# EAGLE design Ultrasound_PCB_Schematic (EAGLE 9.6.2)
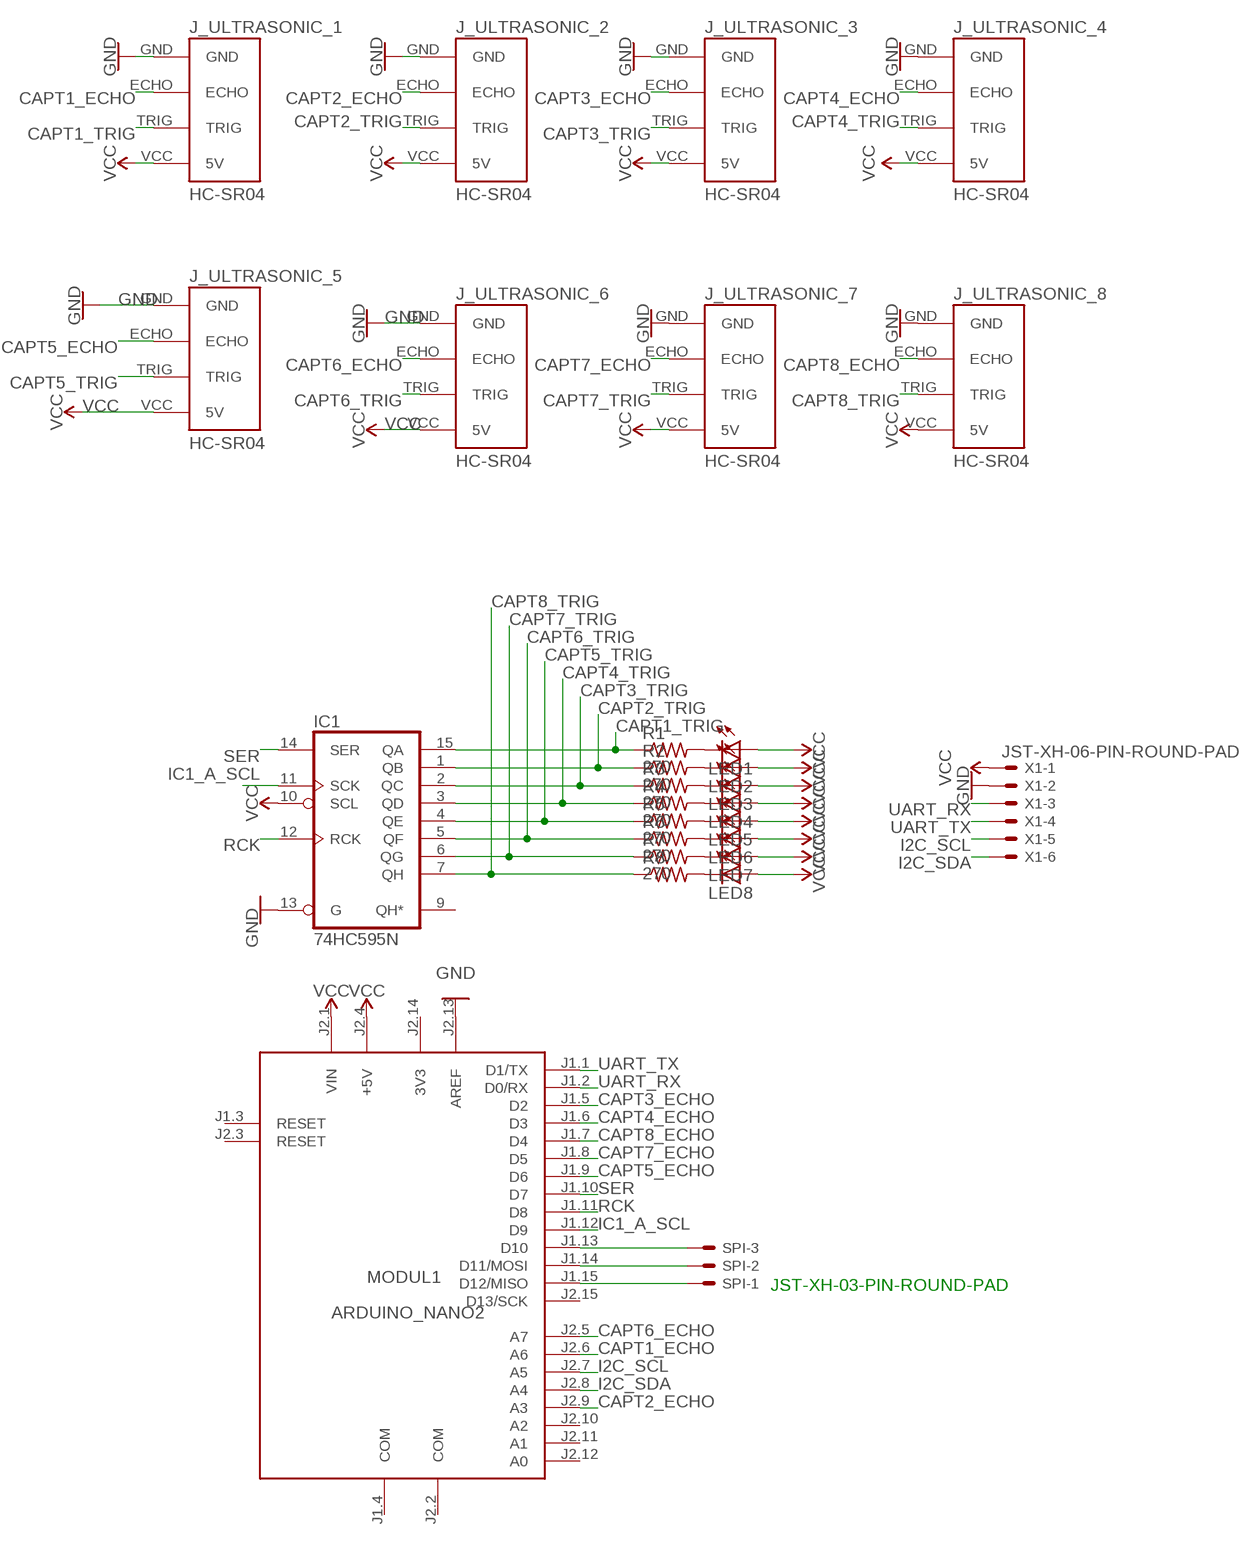
[diagram p0: schematic, sheet 1]

## Parts
IC1  74HC595N  [DIL16]
J_ULTRASONIC_1  HC-SR04  [HC-SR04_FOOTPRINT]
J_ULTRASONIC_2  HC-SR04  [HC-SR04_FOOTPRINT]
J_ULTRASONIC_3  HC-SR04  [HC-SR04_FOOTPRINT]
J_ULTRASONIC_4  HC-SR04  [HC-SR04_FOOTPRINT]
J_ULTRASONIC_5  HC-SR04  [HC-SR04_FOOTPRINT]
J_ULTRASONIC_6  HC-SR04  [HC-SR04_FOOTPRINT]
J_ULTRASONIC_7  HC-SR04  [HC-SR04_FOOTPRINT]
J_ULTRASONIC_8  HC-SR04  [HC-SR04_FOOTPRINT]
LED1  LED5MM  [LED5MM]
LED2  LED5MM  [LED5MM]
LED3  LED5MM  [LED5MM]
LED4  LED5MM  [LED5MM]
LED5  LED5MM  [LED5MM]
LED6  LED5MM  [LED5MM]
LED7  LED5MM  [LED5MM]
LED8  LED5MM  [LED5MM]
MODUL1  ARDUINO_NANO2  [ARDUINO_NANO2]
R1  270  R-US_0207/5V  [0207/5V]
R2  270  R-US_0207/5V  [0207/5V]
R3  270  R-US_0207/5V  [0207/5V]
R4  270  R-US_0207/5V  [0207/5V]
R5  270  R-US_0207/5V  [0207/5V]
R6  270  R-US_0207/5V  [0207/5V]
R7  270  R-US_0207/5V  [0207/5V]
R8  R-US_0207/5V  [0207/5V]
SPI  JST-XH-03-PIN-ROUND-PAD  [JST-XH-03-PACKAGE-ROUND-PAD]
X1  JST-XH-06-PIN-ROUND-PAD  [JST-XH-06-PACKAGE-ROUND-PAD]

## Nets
CAPT1_ECHO: J_ULTRASONIC_1.ECHO MODUL1.J2.6(A6)
CAPT1_TRIG: IC1.15(QA) J_ULTRASONIC_1.TRIG R1.1
CAPT2_ECHO: J_ULTRASONIC_2.ECHO MODUL1.J2.9(A3)
CAPT2_TRIG: IC1.1(QB) J_ULTRASONIC_2.TRIG R2.1
CAPT3_ECHO: J_ULTRASONIC_3.ECHO MODUL1.J1.5(D2)
CAPT3_TRIG: IC1.2(QC) J_ULTRASONIC_3.TRIG R3.1
CAPT4_ECHO: J_ULTRASONIC_4.ECHO MODUL1.J1.6(D3)
CAPT4_TRIG: IC1.3(QD) J_ULTRASONIC_4.TRIG R4.1
CAPT5_ECHO: J_ULTRASONIC_5.ECHO MODUL1.J1.9(D6)
CAPT5_TRIG: IC1.4(QE) J_ULTRASONIC_5.TRIG R5.1
CAPT6_ECHO: J_ULTRASONIC_6.ECHO MODUL1.J2.5(A7)
CAPT6_TRIG: IC1.5(QF) J_ULTRASONIC_6.TRIG R6.1
CAPT7_ECHO: J_ULTRASONIC_7.ECHO MODUL1.J1.8(D5)
CAPT7_TRIG: IC1.6(QG) J_ULTRASONIC_7.TRIG R7.1
CAPT8_ECHO: J_ULTRASONIC_8.ECHO MODUL1.J1.7(D4)
CAPT8_TRIG: IC1.7(QH) J_ULTRASONIC_8.TRIG R8.1
GND: IC1.13(G) J_ULTRASONIC_1.GND J_ULTRASONIC_2.GND J_ULTRASONIC_3.GND J_ULTRASONIC_4.GND J_ULTRASONIC_5.GND J_ULTRASONIC_6.GND J_ULTRASONIC_7.GND J_ULTRASONIC_8.GND MODUL1.J2.13(AREF) X1.2
I2C_SCL: MODUL1.J2.7(A5) X1.5
I2C_SDA: MODUL1.J2.8(A4) X1.6
IC1_A_SCL: IC1.11(SCK) MODUL1.J1.12(D9)
N$9: LED8.K(C) R8.2
N$19: LED7.K(C) R7.2
N$20: LED6.K(C) R6.2
N$21: LED5.K(C) R5.2
N$22: LED4.K(C) R4.2
N$27: MODUL1.J1.15(D12/MISO) SPI.1
N$28: MODUL1.J1.14(D11/MOSI) SPI.2
N$29: MODUL1.J1.13(D10) SPI.3
N$30: LED3.K(C) R3.2
N$31: LED2.K(C) R2.2
N$33: LED1.K(C) R1.2
RCK: IC1.12(RCK) MODUL1.J1.11(D8)
SER: IC1.14(SER) MODUL1.J1.10(D7)
UART_RX: MODUL1.J1.2(D0/RX) X1.3
UART_TX: MODUL1.J1.1(D1/TX) X1.4
VCC: IC1.10(SCL) J_ULTRASONIC_1.VCC(5V) J_ULTRASONIC_2.VCC(5V) J_ULTRASONIC_3.VCC(5V) J_ULTRASONIC_4.VCC(5V) J_ULTRASONIC_5.VCC(5V) J_ULTRASONIC_6.VCC(5V) J_ULTRASONIC_7.VCC(5V) J_ULTRASONIC_8.VCC(5V) LED1.A LED2.A LED3.A LED4.A LED5.A LED6.A LED7.A LED8.A MODUL1.J2.1(VIN) MODUL1.J2.4(+5V) X1.1
Unconnected: IC1.9(QH*) MODUL1.J1.3(RESET) MODUL1.J2.3(RESET) MODUL1.J2.10(A2) MODUL1.J2.11(A1) MODUL1.J2.12(A0) MODUL1.J2.15(D13/SCK)

## Power pins joined to a net without a drawn wire
3V3: MODUL1.J2.14(3V3)
COM: MODUL1.J1.4(COM) MODUL1.J2.2(COM)
GND: IC1.8(GND)
VCC: IC1.16(VCC)

## Library data of the parts
IC1 = 74xx-eu:74*595: 8-bit SHIFT REGISTER, output latch
J_ULTRASONIC_1-J_ULTRASONIC_8 = Ultrasonic Sensor HC RS04:HC-SR04: Ultrasonic Sensor HC-SR04
LED1-LED8 = adafruit:LED: LED OSRAM: - CHIPLED LG R971, LG N971, LY N971, LG Q971, LY Q971, LO R971, LY R971 LH N974, LH R974 LS Q976, LO Q976, LY Q976 LO Q996 - Hyper CHIPLED LW Q18S LB Q993, LB Q99A, LB R99A - SideLED LS A670, LO A670, LY A670, LG A670, LP A670 LB A673, LV A673, LT A673, LW A673 LH A674 LY A675 LS A676, LA A676, LO A676, LY A676, LW A676 LS A679, LY A679, LG A679 - Hyper Micro SIDELED® LS Y876, LA Y876, LO Y876, LY Y876 LT Y87S - SmartLED LW L88C, LW L88S LB L89C, LB L89S, LG L890 LS L89K, LO L89K, LY L89K LS L896, LA L896, LO L896, LY L896 - TOPLED LS T670, LO T670, LY T670, LG T670, LP T670 LSG T670, LSP T670, LSY T670, LOP T670, LYG T670 LG T671, LOG T671, LSG T671 LB T673, LV T673, LT T673, LW T673 LH T674 LS T676, LA T676, LO T676, LY T676, LB T676, LH T676, LSB T676, LW T676 LB T67C, LV T67C, LT T67C, LS T67K, LO T67K, LY T67K, LW E67C LS E67B, LA E67B, LO E67B, LY E67B, LB E67C, LV E67C, LT E67C LW T67C LS T679, LY T679, LG T679 LS T770, LO T770, LY T770, LG T770, LP T770 LB T773, LV T773, LT T773, LW T773 LH T774 LS E675, LA E675, LY E675, LS T675 LS T776, LA T776, LO T776, LY T776, LB T776 LHGB T686 LT T68C, LB T68C - Hyper Mini TOPLED® LB M676 - Mini TOPLED Santana® LG M470 LS M47K, LO M47K, LY M47K Source: http://www.osram.convergy.de/
MODUL1 = arduino:ARDUINO_NANO2: Arduino Nano2 Auto generated by modulcreator.ulp \;; ANZAHL: 2; MODUL: TRUE; STECKX0: -76200; STECKX1: 76200; STECKY0: 177800; STECKY1: 177800
R1-R8 = adafruit:R-US_: RESISTOR, American symbol
SPI = Rembrandt Electronics - JST XH Connectors v1-0:JST-XH-03-PIN: JST XH Connector 2 Pin Wire to board connector. Pitch: 2,54 mm, (0.100") Number of pins: 3 Created by Rembrandt Electronics www.rembrandtelectronics.com; SPICEPREFIX: X
X1 = Rembrandt Electronics - JST XH Connectors v1-0:JST-XH-06-PIN: JST XH Connector 2 Pin Wire to board connector. Pitch: 2,54 mm, (0.100") Number of pins: 6 Created by Rembrandt Electronics www.rembrandtelectronics.com

## Net classes
0 default: width 1 mm, drill 1 mm

## Board
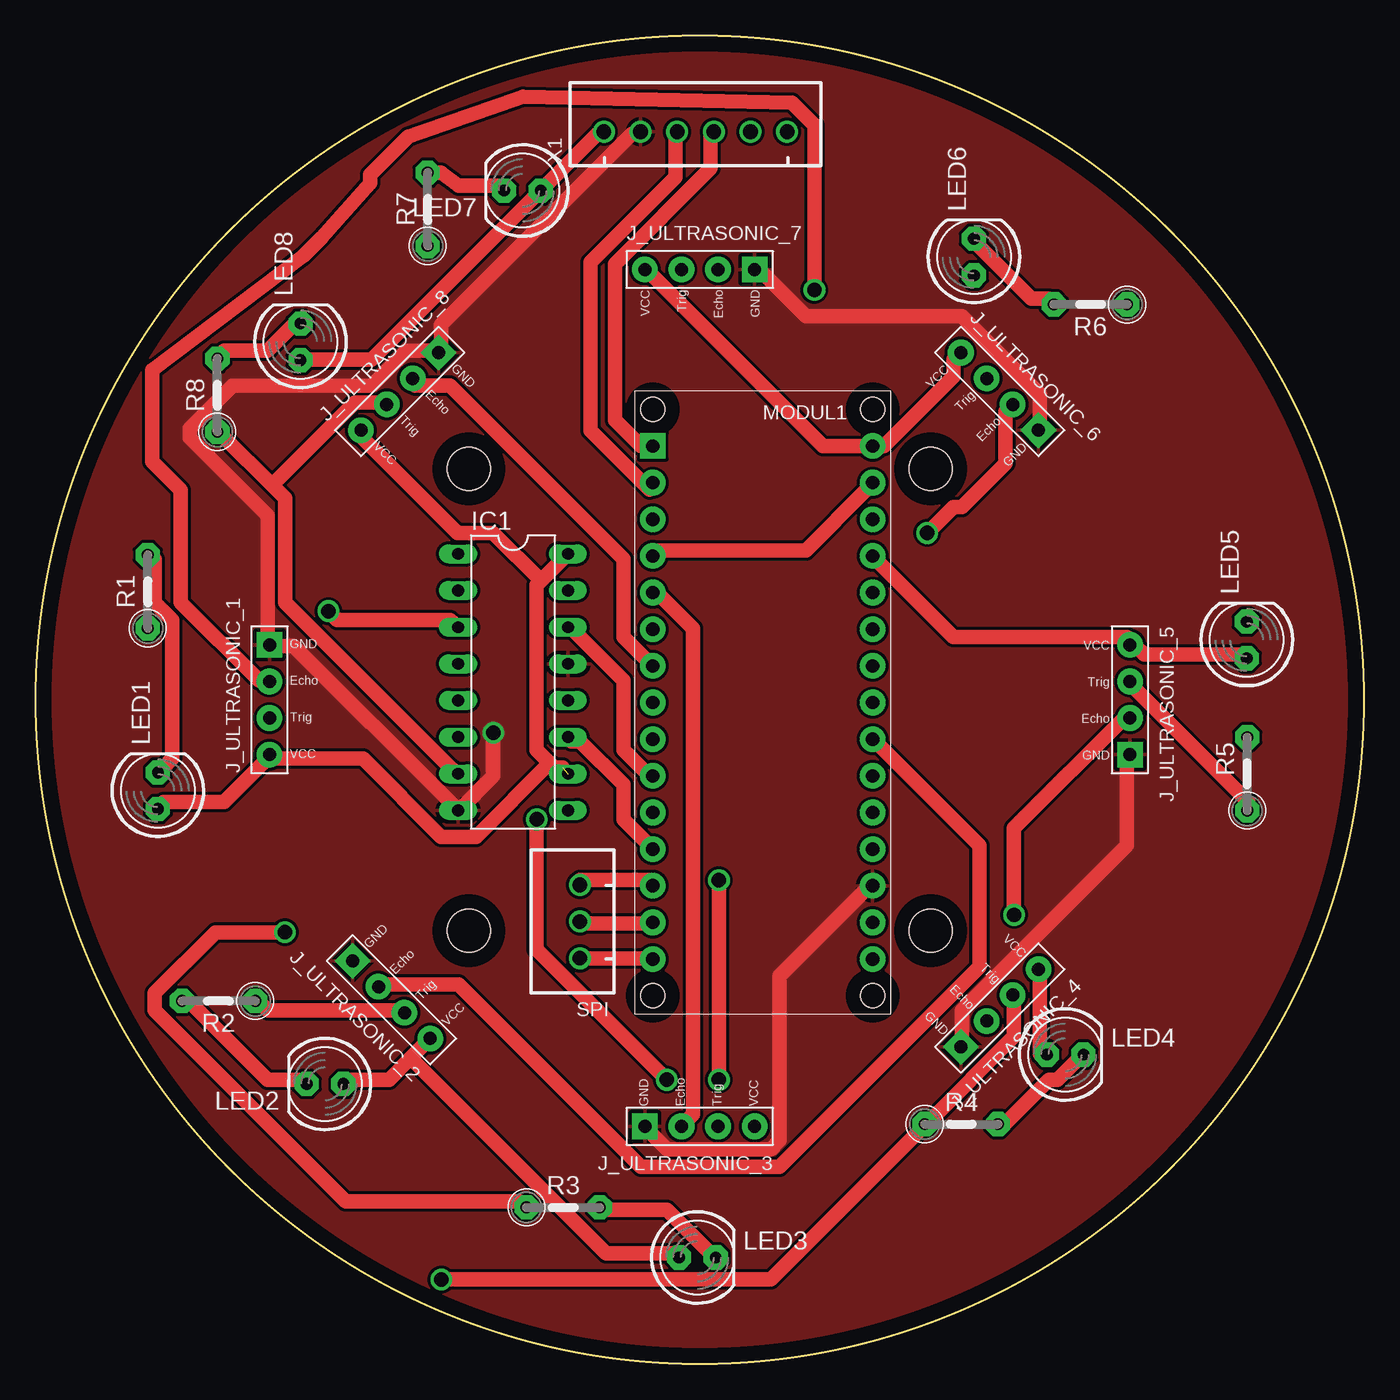
[diagram p1: board, top side]
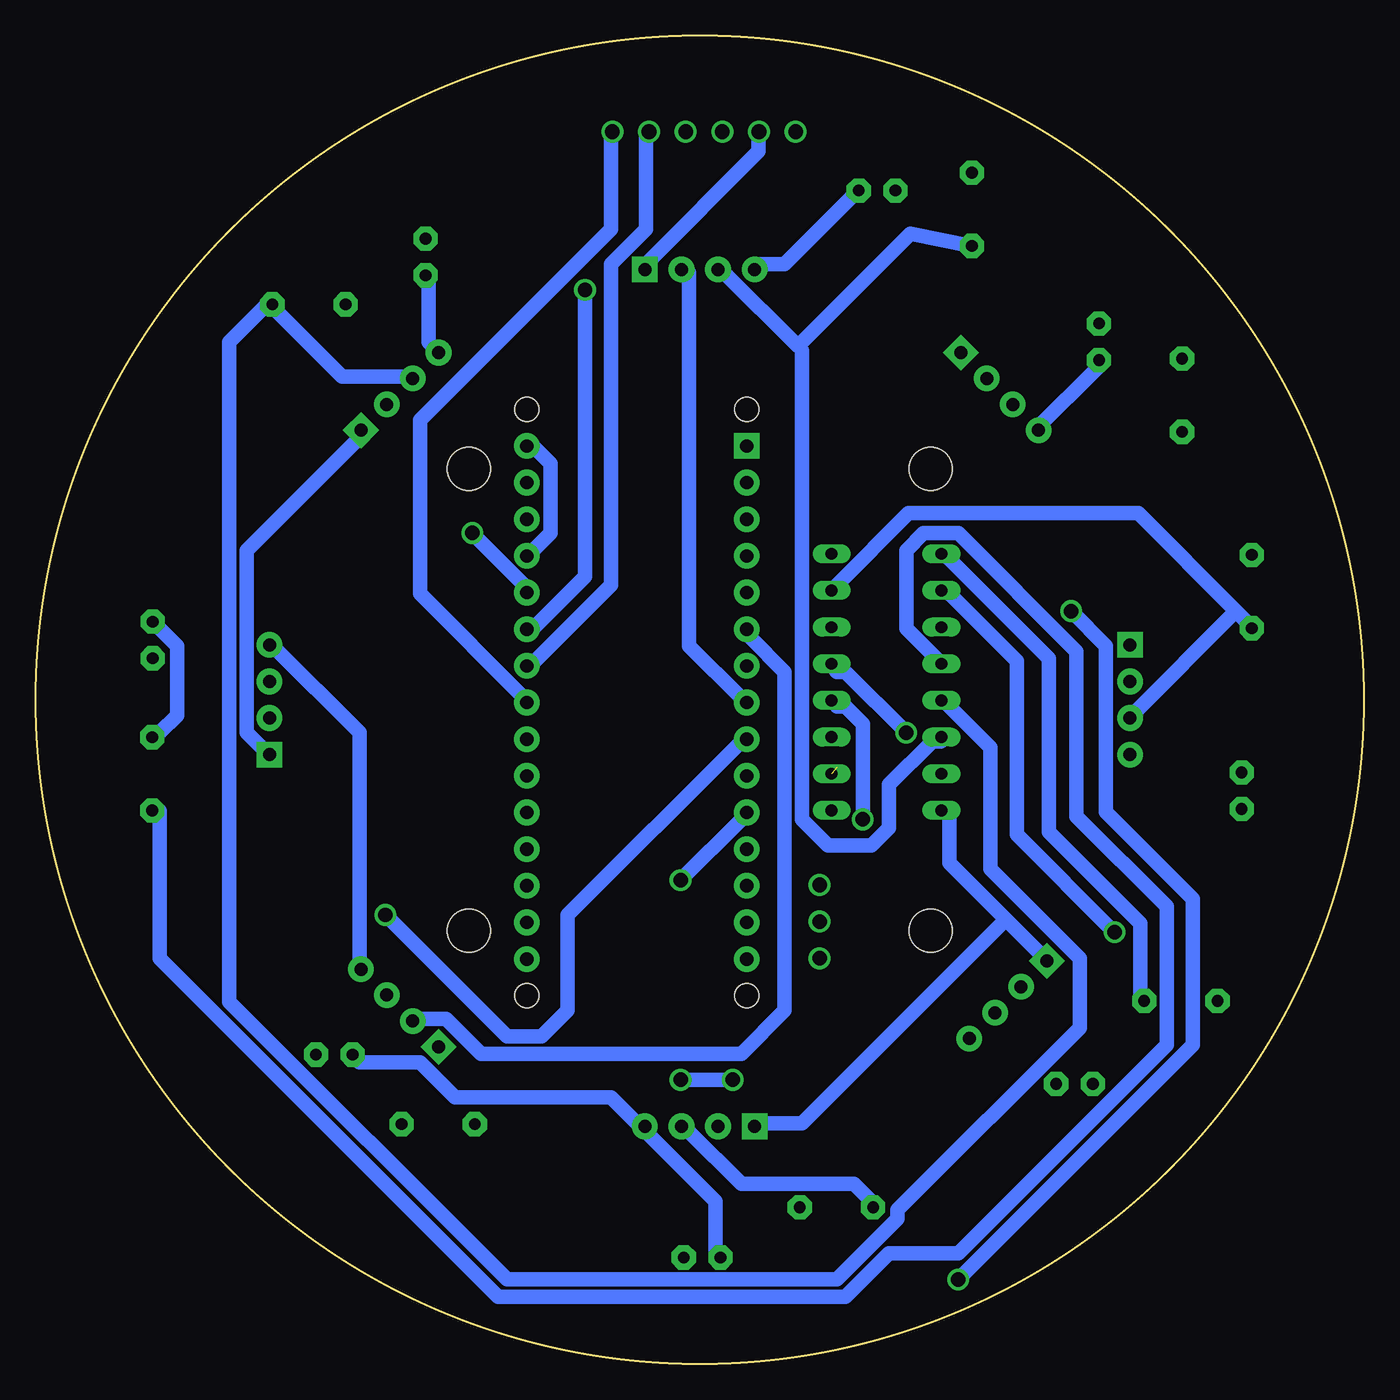
[diagram p2: board, bottom side, seen from below]

Size 92 x 92 mm. Coordinates in mm from the lower left corner, seen from the top.
Outline: circle at 46,46 radius 46
Copper layers (1*16): Top 0.035mm / dielectric 1.5mm / Bottom 0.035mm
Design rules "default *": minimum track width 6mil, minimum drill 0.35mm, track to track 8mil, track to pad 6mil, pad to pad 6mil, via to via 6mil, smd to smd 6mil, copper to edge 40mil, drill to drill 6mil, minimum pad ring 10mil, minimum via ring 8mil, stop-mask expansion 4mil, vias tented up to drill 0mil, thermal gap 10mil
Holes 3 mm at 30,30 62,62 30,62 62,30

### Footprints (pad centres in the part's own frame; a part is rotated, then mirrored left to right if it is on the bottom)
DIL16 = drill 0.813 long: 1 -8.89,-3.81; 2 -6.35,-3.81; 3 -3.81,-3.81; 4 -1.27,-3.81; 5 1.27,-3.81; 6 3.81,-3.81; 7 6.35,-3.81; 8 8.89,-3.81; 9 8.89,3.81; 10 6.35,3.81; 11 3.81,3.81; 12 1.27,3.81; 13 -1.27,3.81; 14 -3.81,3.81; 15 -6.35,3.81; 16 -8.89,3.81
HC-SR04_FOOTPRINT = drill 0.9 pad 1.778: ECHO 0,1.27; TRIG 0,-1.27; VCC 0,-3.81 | drill 0.9 pad 1.778 square: GND 0,3.81
LED5MM = drill 0.813 pad 1.676 octagon: A -1.27,0; K 1.27,0
ARDUINO_NANO2 = drill 0.914 pad 1.778 square: J1.1 -7.62,17.78 | drill 0.914 pad 1.778: J1.2 -7.62,15.24; J1.3 -7.62,12.7; J1.4 -7.62,10.16; J1.5 -7.62,7.62; J1.6 -7.62,5.08; J1.7 -7.62,2.54; J1.8 -7.62,0; J1.9 -7.62,-2.54; J1.10 -7.62,-5.08; J1.11 -7.62,-7.62; J1.12 -7.62,-10.16; J1.13 -7.62,-12.7; J1.14 -7.62,-15.24; J1.15 -7.62,-17.78; J2.1 7.62,17.78; J2.2 7.62,15.24; J2.3 7.62,12.7; J2.4 7.62,10.16; J2.5 7.62,7.62; J2.6 7.62,5.08; J2.7 7.62,2.54; J2.8 7.62,0; J2.9 7.62,-2.54; J2.10 7.62,-5.08; J2.11 7.62,-7.62; J2.12 7.62,-10.16; J2.13 7.62,-12.7; J2.14 7.62,-15.24; J2.15 7.62,-17.78 | hole 1.651: -7.62,-20.32; 7.62,-20.32; 7.62,20.32; -7.62,20.32
0207/5V = drill 0.813 pad 1.676 octagon: 1 -2.54,0; 2 2.54,0
JST-XH-03-PACKAGE-ROUND-PAD = drill 1.016: 1 -2.54,0; 2 0,0; 3 2.54,0
JST-XH-06-PACKAGE-ROUND-PAD = drill 1.016: 1 -6.35,0; 2 -3.81,0; 3 -1.27,0; 4 1.27,0; 5 3.81,0; 6 6.35,0

### Placement (x,y rotation side)
IC1  33.06,47.22 270 top
J_ULTRASONIC_1  16.18,46 0 top
J_ULTRASONIC_2  24.63,25.21 45 top
J_ULTRASONIC_3  46,16.43 90 top
J_ULTRASONIC_4  66.79,24.63 135 top
J_ULTRASONIC_5  75.82,46 180 top
J_ULTRASONIC_6  66.79,67.37 225 top
J_ULTRASONIC_7  46,75.82 270 top
J_ULTRASONIC_8  25.21,67.37 315 top
LED1  8.44,39.69 90 top
LED2  20.03,19.37 180 top
LED3  45.84,7.34 0 top
LED4  71.33,21.41 0 top
LED5  83.91,50.14 90 top
LED6  65.01,76.69 90 top
LED7  33.71,81.29 180 top
LED8  18.33,70.81 90 top
MODUL1  50.36,45.81 0 top
R1  7.74,53.5 90 top
R2  12.65,25.12 180 top
R3  36.53,10.82 0 top
R4  64.13,16.59 0 top
R5  83.95,40.86 90 top
R6  73.08,73.4 180 top
R7  27.14,79.99 90 top
R8  12.56,67.1 90 top
SPI  37.69,30.62 90 top
X1  45.7,85.37 0 top

### Tracks (layer width: path | path; a pad name or v marks a point on that pad's centre or on a via)
CAPT1_ECHO  (via drill 1)
  Top 1: v53.95,74.4 53.95,85.83 52.39,87.39 33.76,87.8 25.79,85.02 23.16,82.39 23.16,81.81 19.78,78.03 18.53,76.79 8.06,68.84 8.06,62.52 10.03,60.54 10.03,52.75 15.45,47.33 16.05,47.33 J_ULTRASONIC_1.ECHO
  Bottom 1: v53.95,74.4 53.95,54.55 57.56,50.94 MODUL1.J2.6
CAPT1_TRIG
  Bottom 1: 8.83,52.14 8.23,51.54 R1.1 | 8.83,52.14 15.61,58.93 31.52,58.93 36.5,53.95 IC1.15 | 8.83,52.14 16.05,44.92 J_ULTRASONIC_1.TRIG
CAPT2_ECHO
  Top 1: MODUL1.J2.9 58.16,43.12 65.38,35.9 65.38,27.48 51.54,13.64 41.92,13.64 29.28,26.27 23.87,26.27 J_ULTRASONIC_2.ECHO
CAPT2_TRIG
  Top 1: R2.1 15.45,25.07 16.05,24.47 25.07,24.47 J_ULTRASONIC_2.TRIG
  Bottom 1: IC1.1 28.68,55.75 21.79,48.86 21.79,36.83 15.45,30.49 15.45,25.67 R2.1
CAPT3_ECHO
  Top 1: MODUL1.J1.5 43.12,53.35 45.53,50.94 45.53,17.25 44.92,16.65 J_ULTRASONIC_3.ECHO
CAPT3_TRIG  (via drill 1)
  Top 1: v17.25,29.89 12.44,29.89 8.23,25.67 8.23,24.47 21.46,11.23 33.49,11.23 R3.1
  Bottom 1: v17.25,29.89 24.02,36.65 24.02,48.68 28.68,53.35 IC1.2 | R3.1 34.1,11.23 35.3,12.44 43.12,12.44 46.73,16.05 J_ULTRASONIC_3.TRIG
CAPT4_ECHO
  Bottom 1: MODUL1.J1.6 42.52,50.34 40.11,47.93 40.11,24.47 43.12,21.46 61.17,21.46 63.57,23.87 65.38,23.87 J_ULTRASONIC_4.ECHO
CAPT4_TRIG  (via drill 1)
  Top 1: v20.26,52.14 20.86,51.54 28.68,51.54 IC1.3 | v28.08,5.82 50.94,5.82 61.17,16.05 R4.1 61.77,16.65 67.79,22.67 67.79,25.07 J_ULTRASONIC_4.TRIG
  Bottom 1: v20.26,52.14 17.85,49.74 17.85,38.23 11.81,32.19 11.81,22.09 v28.08,5.82
CAPT5_ECHO  (via drill 1)
  Top 1: v67.79,31.09 67.79,37.1 75.61,44.92 J_ULTRASONIC_5.ECHO
  Bottom 1: v67.79,31.09 59.36,22.67 56.96,22.67 55.15,24.47 55.15,31.09 43.12,43.12 MODUL1.J1.9
CAPT5_TRIG
  Top 1: R5.1 84.03,38.91 76.21,46.73 J_ULTRASONIC_5.TRIG
  Bottom 1: IC1.4 29.28,48.53 31.69,50.94 31.69,56.35 30.49,57.56 28.08,57.56 19.88,49.36 19.88,37.9 13.64,31.66 13.64,22.06 28.08,7.63 32.89,7.63 35.9,4.62 59.97,4.62 83.43,28.08 83.43,38.31 R5.1
CAPT6_ECHO  (via drill 1)
  Top 1: MODUL1.J2.5 57.98,53.42 57.62,53.42 | v61.77,57.56 63.57,59.36 64.18,59.36 67.18,62.37 67.18,65.98 J_ULTRASONIC_6.ECHO
  Bottom 1: v61.77,57.56 58.16,53.95 MODUL1.J2.5
CAPT6_TRIG
  Bottom 1: IC1.5 28.68,45.53 25.85,42.69 25.85,34.27 19.66,28.08 19.66,23.27 32.29,10.63 32.29,10.03 36.5,5.82 59.36,5.82 78.61,25.07 78.61,70.79 76.21,73.2 R6.1 75.61,73.2 70.79,68.39 65.98,68.39 J_ULTRASONIC_6.TRIG
CAPT7_ECHO
  Bottom 1: MODUL1.J1.8 43.12,46.13 46.73,49.74 46.73,75.61 J_ULTRASONIC_7.ECHO
CAPT7_TRIG
  Bottom 1: 39.21,70.49 44.32,75.61 J_ULTRASONIC_7.TRIG | 39.21,70.49 38.91,70.19 38.91,37.71 37.1,35.9 34.1,35.9 32.89,37.1 32.89,40.11 29.89,43.12 29.28,43.12 IC1.6 | 39.21,70.49 31.41,78.29 R7.1
CAPT8_ECHO
  Top 1: MODUL1.J1.7 42.52,48.53 40.71,50.34 40.71,55.75 28.68,67.79 26.27,67.79 J_ULTRASONIC_8.ECHO
CAPT8_TRIG
  Top 1: 16.35,60.87 13.04,64.18 R8.1 | 16.35,60.87 17.25,59.97 17.25,52.75 28.68,41.31 IC1.7 | 16.35,60.87 22.06,66.58 23.87,66.58 J_ULTRASONIC_8.TRIG
COM
  Top 1: MODUL1.J1.4 43.12,56.35 53.35,56.35 57.56,60.57 MODUL1.J2.2
GND  (via drill 1)
  Top 1: v31.69,43.72 31.69,40.71 29.28,38.31 IC1.8 28.68,38.91 17.85,49.74 16.65,49.74 J_ULTRASONIC_1.GND 16.05,50.34 16.05,58.76 10.63,64.18 10.63,64.78 13.64,67.79 23.27,67.79 25.67,70.19 27.48,70.19 J_ULTRASONIC_8.GND 28.08,70.19 28.08,72 41.31,85.23 X1.2 | MODUL1.J2.13 57.56,32.89 51.54,26.88 51.54,15.45 50.94,14.84 43.72,14.84 42.52,16.05 J_ULTRASONIC_3.GND | J_ULTRASONIC_4.GND 64.18,22.06 64.18,24.47 75.61,35.9 75.61,41.92 J_ULTRASONIC_5.GND | J_ULTRASONIC_6.GND 69.59,64.78 69.59,67.18 64.18,72.6 53.35,72.6 50.34,75.61 J_ULTRASONIC_7.GND
  Bottom 1: 24.77,30.79 22.06,28.08 J_ULTRASONIC_2.GND | 24.77,30.79 28.68,34.7 28.68,38.31 IC1.8 | v31.69,43.72 35.9,47.93 36.5,47.93 IC1.13 | 24.77,30.79 38.91,16.65 41.92,16.65 J_ULTRASONIC_3.GND | X1.2 41.92,85.23 41.92,84.03 49.74,76.21 J_ULTRASONIC_7.GND | J_ULTRASONIC_5.GND 76.21,42.52 77.41,43.72 77.41,56.35 69.59,64.18 J_ULTRASONIC_6.GND
  pour Top: 71.05,93.63 94.8,69.88 94.8,16.27 77.72,-0.82 19.62,-0.82 -0.82,19.63 -0.82,60.75 9.95,89.89 13.7,93.63
I2C_SCL
  Bottom 1: X1.5 49.74,85.23 49.74,78.61 52.14,76.21 52.14,53.95 57.56,48.53 MODUL1.J2.7
I2C_SDA
  Bottom 1: X1.6 52.14,85.23 52.14,78.61 65.38,65.38 65.38,53.35 58.16,46.13 MODUL1.J2.8
IC1_A_SCL
  Top 1: IC1.11 37.1,43.12 37.71,43.12 40.71,40.11 40.71,37.71 42.52,35.9 MODUL1.J1.12
N$9
  Top 1: R8.2 13.04,70.19 16.05,70.19 17.85,72 LED8.K
N$19
  Top 1: LED7.K 32.29,81.62 29.28,81.62 28.09,82.53 R7.2
N$20
  Top 1: R6.2 70.19,73.8 68.99,73.8 65.38,77.41 LED6.K
N$21
  Bottom 1: LED5.K 83.43,50.94 82.22,49.74 82.22,44.92 83.43,43.72 R5.2
N$22
  Top 1: R4.2 67.18,16.65 70.19,19.66 70.79,19.66 72,20.86 LED4.K
N$27
  Top 1: SPI.1 37.71,28.08 42.52,28.08 MODUL1.J1.15
N$28
  Top 1: SPI.2 37.71,30.49 42.52,30.49 MODUL1.J1.14
N$29
  Top 1: SPI.3 37.71,33.49 42.52,33.49 MODUL1.J1.13
N$30
  Top 1: LED3.K 46.73,7.63 43.72,10.63 39.51,10.63 R3.2
N$31
  Top 1: LED2.K 18.45,19.66 16.05,19.66 10.63,25.07 R2.2
N$33
  Top 1: R1.2 8.23,55.75 8.23,52.75 9.43,51.54 9.43,41.92 8.83,41.31 LED1.K
RCK  (via drill 1)
  Top 1: v34.7,37.71 34.7,28.68 v43.72,19.66 | v47.33,33.49 v47.33,19.66
  Bottom 1: v34.7,37.71 34.7,44.32 35.9,45.53 36.5,45.53 IC1.12 | v47.33,19.66 v43.72,19.66 | v47.33,33.49 43.12,37.71 MODUL1.J1.11
SER
  Top 1: MODUL1.J1.10 42.52,40.71 40.71,42.52 40.71,47.33 37.1,50.94 IC1.14
UART_RX
  Top 1: MODUL1.J1.2 42.52,60.57 38.42,64.67 38.42,76.32 44.32,82.22 44.32,85.23 X1.3
UART_TX
  Top 1: MODUL1.J1.1 42.52,63.57 41.92,63.57 40.11,65.38 40.11,76.21 46.73,82.83 46.73,85.23 X1.4
VCC  (1 unrouted)
  Top 1: 25.97,21.16 26.88,22.06 J_ULTRASONIC_2.VCC | 25.97,21.16 24.47,19.66 21.46,19.66 LED2.A | LED4.A 69.59,21.46 69.59,26.88 J_ULTRASONIC_4.VCC | 25.97,21.16 39.51,7.63 44.32,7.63 LED3.A | LED1.A 8.83,38.91 13.04,38.91 16.05,41.92 J_ULTRASONIC_1.VCC 16.65,41.92 22.67,41.92 28.08,36.5 30.49,36.5 35.6,41.62 | 36.5,41.31 35.9,41.31 35.6,41.62 | 35.6,41.62 34.7,42.52 34.7,53.95 35,54.25 | 35,54.25 36.5,55.75 IC1.16 | 35,54.25 31.69,57.56 29.2,57.56 22.7,64.06 J_ULTRASONIC_8.VCC | X1.1 38.91,85.23 35.3,81.62 LED7.A 34.7,81.02 23.27,69.59 18.45,69.59 LED8.A | LED5.A 83.43,49.14 76.81,49.14 76.21,49.74 J_ULTRASONIC_5.VCC 75.61,50.34 63.57,50.34 58.16,55.75 MODUL1.J2.4 | J_ULTRASONIC_6.VCC 63.57,69.59 63.57,68.39 58.76,63.57 58.16,63.57 MODUL1.J2.1 57.56,63.57 54.55,63.57 42.52,75.61 J_ULTRASONIC_7.VCC
  Bottom 1: LED3.A 44.92,7.63 44.92,11.23 49.74,16.05 J_ULTRASONIC_3.VCC 50.34,16.65 52.14,18.45 62.97,18.45 65.38,20.86 69.59,20.86 LED4.A | LED8.A 18.45,68.99 22.67,64.78 J_ULTRASONIC_8.VCC | J_ULTRASONIC_7.VCC 41.92,76.21 40.11,76.21 35.3,81.02 LED7.A | LED6.A 64.78,75 64.78,70.79 64.18,70.19 J_ULTRASONIC_6.VCC | MODUL1.J2.4 57.56,56.35 56.35,57.56 56.35,62.37 57.56,63.57 MODUL1.J2.1 | J_ULTRASONIC_4.VCC 69.59,27.48 69.59,43.72 75.61,49.74 J_ULTRASONIC_5.VCC